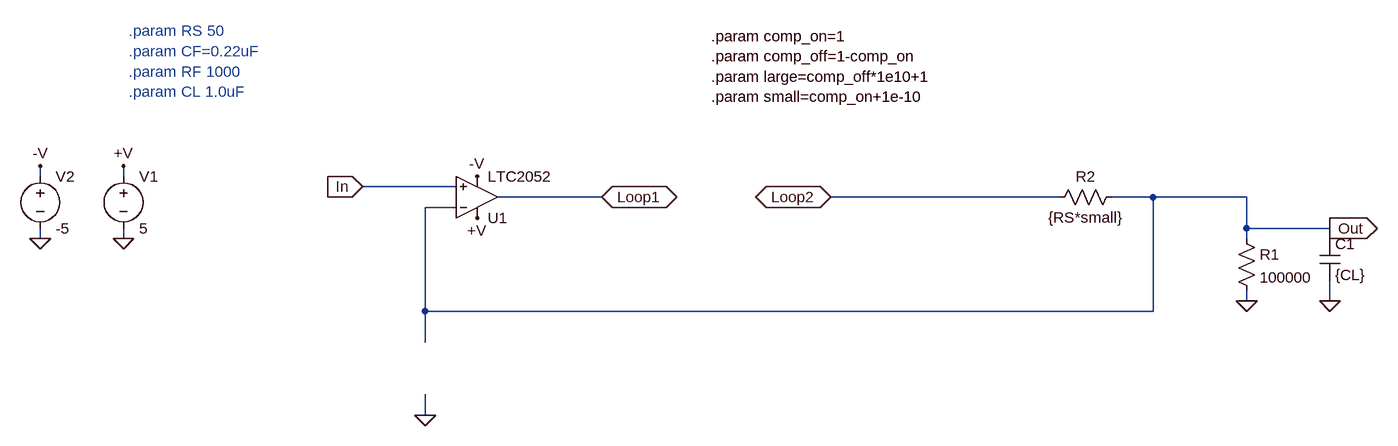
[diagram p0: schematic system_model_rser.asc]
system_model_rser.asc, the LTspice schematic file:
Version 4
SHEET 1 1108 680
WIRE -976 -16 -976 -32
WIRE -848 -16 -848 -32
WIRE -336 0 -480 0
WIRE -112 16 -272 16
WIRE 592 16 240 16
WIRE 736 16 672 16
WIRE 880 16 736 16
WIRE -336 32 -384 32
WIRE 880 64 880 16
WIRE 1008 64 880 64
WIRE -976 80 -976 64
WIRE -848 80 -848 64
WIRE 880 80 880 64
WIRE 1008 80 1008 64
WIRE 880 176 880 160
WIRE 1008 176 1008 144
WIRE -384 192 -384 32
WIRE 736 192 736 16
WIRE 736 192 -384 192
WIRE -384 240 -384 192
WIRE -384 352 -384 320
FLAG 880 176 0
FLAG 1008 176 0
FLAG -304 -16 -V
FLAG -304 48 +V
FLAG -384 352 0
FLAG -112 16 Loop1
IOPIN -112 16 BiDir
FLAG 240 16 Loop2
IOPIN 240 16 BiDir
FLAG -480 0 In
IOPIN -480 0 In
FLAG 1008 64 Out
IOPIN 1008 64 Out
FLAG -848 80 0
FLAG -848 -32 +V
FLAG -976 80 0
FLAG -976 -32 -V
SYMBOL res 864 64 R0
SYMATTR InstName R1
SYMATTR Value 100000
SYMBOL cap 992 80 R0
SYMATTR InstName C1
SYMATTR Value {CL}
SYMBOL res 688 0 R90
WINDOW 0 0 56 VBottom 2
WINDOW 3 32 56 VTop 2
SYMATTR InstName R2
SYMATTR Value {RS*small}
SYMBOL Opamps\\LTC2052 -304 16 M180
SYMATTR InstName U1
SYMBOL voltage -848 -32 R0
SYMATTR InstName V1
SYMATTR Value 5
SYMBOL voltage -976 -32 R0
SYMATTR InstName V2
SYMATTR Value -5
TEXT 56 -232 Left 2 !.param comp_on=1\n.param comp_off=1-comp_on\n.param large=comp_off*1e10+1\n.param small=comp_on+1e-10
TEXT -840 -240 Left 2 ;.param RS 50\n.param CF=0.22uF\n.param RF 1000\n.param CL 1.0uF

The netlist it stands for:
* system_model_rser.asc
R1 Out 0 100000
C1 Out 0 {CL}
R2 Out Loop2 {RS*small}
* U1: LTC2052 (symbol Opamps\LTC2052 not available, pins judged from their places): In+=In In-=Out V+=+V V-=-V OUT=Loop1
V1 +V 0 5
V2 -V 0 -5
.param comp_on=1
.param comp_off=1-comp_on
.param large=comp_off*1e10+1
.param small=comp_on+1e-10
* .param RS 50
* .param CF=0.22uF
* .param RF 1000
* .param CL 1.0uF
.backanno
.end